# Altium schematic sheet 05-Power_A.SchDoc
size A
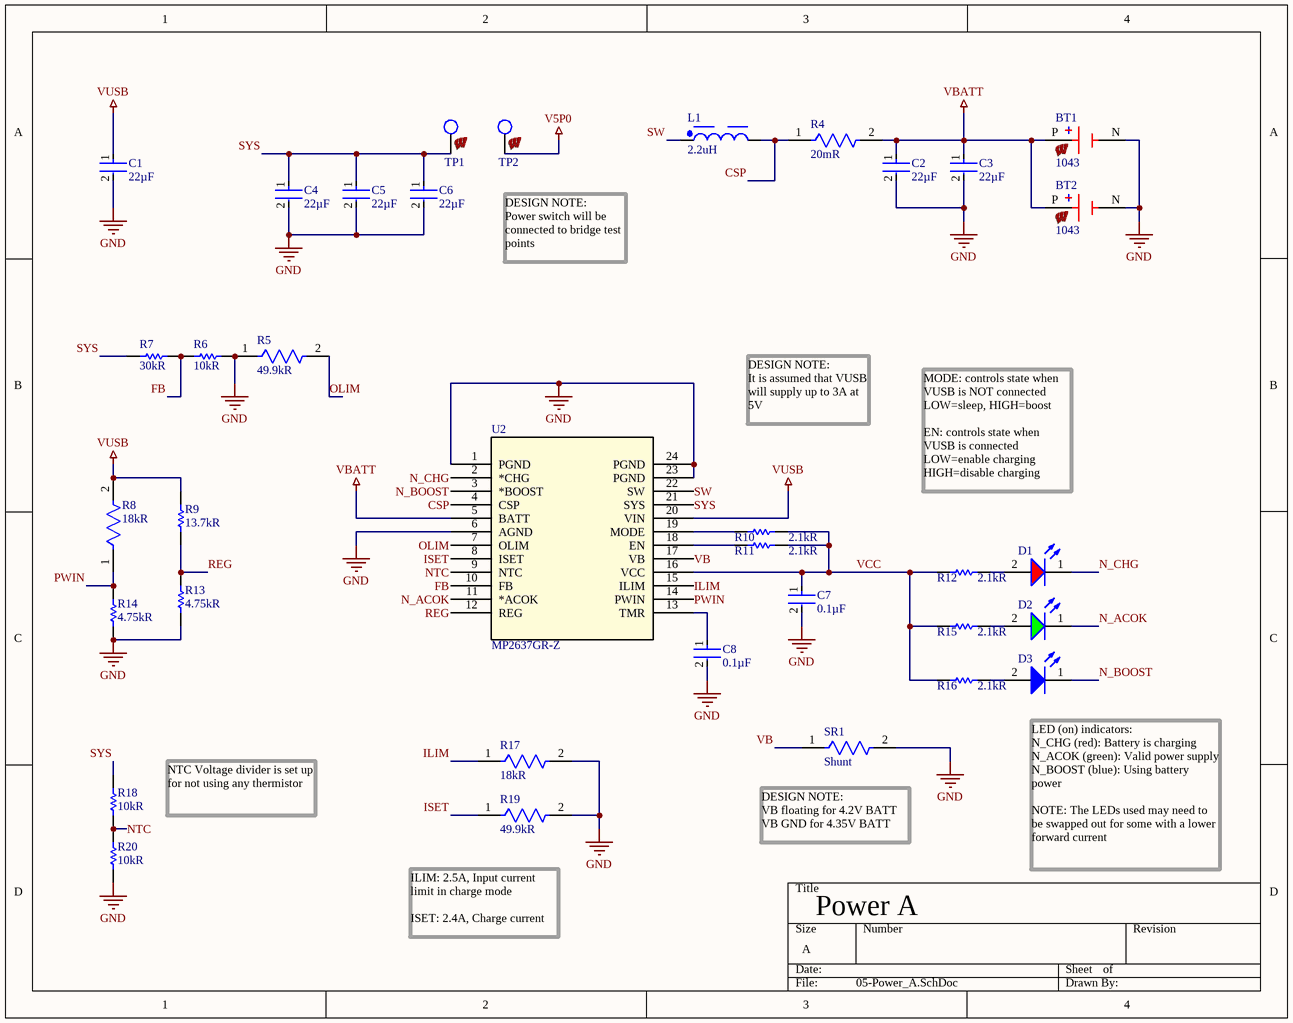
[diagram p0: 05-Power_A.SchDoc]

## Parts
BT1  1043  [BAT_1043]
BT2  1043  [BAT_1043]
C1  22µF  [FP-GRM21B-0_2-e0_2_0_7-IPC_B]
C2  22µF  [FP-GRM21B-0_2-e0_2_0_7-IPC_B]
C3  22µF  [FP-GRM21B-0_2-e0_2_0_7-IPC_B]
C4  22µF  [FP-GRM21B-0_2-e0_2_0_7-IPC_B]
C5  22µF  [FP-GRM21B-0_2-e0_2_0_7-IPC_B]
C6  22µF  [FP-GRM21B-0_2-e0_2_0_7-IPC_B]
C7  0.1µF  [FP-C0805C-DN-MFG]
C8  0.1µF  [FP-C0805C-DN-MFG]
D1  150080RS75000  [WL-SMCW_0805_150080xx75000]  (value not drawn)
D2  150080GS75000  [WL-SMCW_0805_150080xx75000]  (value not drawn)
D3  150080BS75000  [WL-SMCW_0805_150080xx75000]  (value not drawn)
L1  2.2uH  [WE-TPC_8043]
R4  20mR  [FP-CSR0805-MFG]
R5  49.9kR  [FP-RMCF0805-IPC_A]
R6  10kR  [RESC2013X70X40ML20T20]
R7  30kR  [RESC2013X70X40LL20T20]
R8  18kR  [FP-CRGP0805-IPC_C]
R9  13.7kR  [RESC2013X70X40ML20T20]
R10  2.1kR  [RESC2013X70X40ML20T20]
R11  2.1kR  [RESC2013X70X40ML20T20]
R12  2.1kR  [RESC2013X70X40ML20T20]
R13  4.75kR  [RESC2013X50X30LL20T20]
R14  4.75kR  [RESC2013X50X30LL20T20]
R15  2.1kR  [RESC2013X70X40ML20T20]
R16  2.1kR  [RESC2013X70X40ML20T20]
R17  18kR  [FP-CRGP0805-IPC_C]
R18  10kR  [RESC2013X70X40ML20T20]
R19  49.9kR  [FP-RMCF0805-IPC_A]
R20  10kR  [RESC2013X70X40ML20T20]
SR1  Shunt  [FP-CSSH0805FT1L00-MFG]
TP1  TP  [TP_UW]  (value not drawn)  (no BOM)
TP2  TP  [TP_UW]  (value not drawn)  (no BOM)
U2  MP2637GR-Z  [QFN-24_MP2637_MNP]

## Nets
GND: BT1.N(NEG) BT2.N(NEG) C1.2 C2.2 C3.2 C4.2 C5.2 C6.2 C7.2 C8.2 R5.1 R6.2 R13.1 R14.1 R17.2 R19.2 R20.1 SR1.2 U2.1(PGND) U2.6(AGND) U2.23(PGND) U2.24(PGND)
V5P0: TP2.1
VBATT: BT1.P(POS) BT2.P(POS) C2.1 C3.1 R4.2 U2.5(BATT)
VUSB: C1.1 R8.2 R9.2 U2.20(VIN)
CSP: L1.2 R4.1 U2.4(CSP)
FB: R6.1 R7.2 U2.10(FB)
ILIM: R17.1 U2.15(ILIM)
ISET: R19.1 U2.8(ISET)
N_ACOK: D2.1(K) U2.11(*ACOK)
N_BOOST: D3.1(K) U2.3(*BOOST)
N_CHG: D1.1(K) U2.2(*CHG)
NTC: R18.1 R20.2 U2.9(NTC)
OLIM: R5.2 U2.7(OLIM)
PWIN: R8.1 R14.2 U2.14(PWIN)
REG: R9.1 R13.2 U2.12(REG)
SW: L1.1 U2.22(SW)
SYS: C4.1 C5.1 C6.1 R7.1 R18.2 TP1.1 U2.21(SYS)
VB: SR1.1 U2.17(VB)
VCC: C7.1 R10.2 R11.2 R12.1 R15.1 R16.1 U2.16(VCC)
NetC8_1: C8.1 U2.13(TMR)
NetD1_2: D1.2(A) R12.2
NetD2_2: D2.2(A) R15.2
NetD3_2: D3.2(A) R16.2
NetR10_1: R10.1 U2.19(MODE)
NetR11_1: R11.1 U2.18(EN)

## Notes on the sheet
- DESIGN NOTE:
  Power switch will be connected to bridge test points
- DESIGN NOTE:
  It is assumed that VUSB will supply up to 3A at 5V
- MODE: controls state when VUSB is NOT connected
  LOW=sleep, HIGH=boost
  EN: controls state when VUSB is connected
  LOW=enable charging
  HIGH=disable charging
- NTC Voltage divider is set up for not using any thermistor
- (near SR1) DESIGN NOTE:
  VB floating for 4.2V BATT
  VB GND for 4.35V BATT
- (near D3) LED (on) indicators:
  N_CHG (red): Battery is charging
  N_ACOK (green): Valid power supply
  N_BOOST (blue): Using battery power
  NOTE: The LEDs used may need to be swapped out for some with a lower forward current
- ILIM: 2.5A, Input current limit in charge mode
  ISET: 2.4A, Charge current
- Power A

## Library data of the parts
BT1 BT2 = 1043: Manufacturer: Keystone Electronics; Price: None; Availability: Unavailable; Value: *; MP: 1043; Package: None; Supplier: Digikey; Supplier Part Number: 36-1043-ND; Manufacturer Part Number: 1043; RoHS: Yes; Category: Batteries and Accessories; Stock: 4625; Pricing: 1=3.38, 25=2.604, 100=2.328, 250=2.16176, 500=2.04398, 1000=1.9326, 2500=1.79464, 5000=1.69686 (USD); ComponentLink1URL: https://datasheet.ciiva.com/4/1043-4710.pdf?src-supplier=Digikey; ComponentLink1Description: https://datasheet.ciiva.com/4/1043-4710.pdf?src-supplier=Digikey; ComponentLink2URL: https://datasheet.ciiva.com/3353/1043-eng-tds-3353208.pdf?src-supplier=Distrelec; ComponentLink2Description: https://datasheet.ciiva.com/3353/1043-eng-tds-3353208.pdf?src-supplier=Distrelec; ComponentLink3URL: https://datasheet.ciiva.com/41803/1043-41803215.pdf?src-supplier=Digikey; ComponentLink3Description: https://datasheet.ciiva.com/41803/1043-41803215.pdf?src-supplier=Digikey; ComponentLink4URL: https://datasheet.ciiva.com/4642/1043-4642493.pdf?src-supplier=Mouser; ComponentLink4Description: https://datasheet.ciiva.com/4642/1043-4642493.pdf?src-supplier=Mouser
C1-C6 = CMP-06035-023072-1: Chip Multilayer Ceramic Capacitors for General Purpose, 0805, 22uF, X7R, 15%, 20%, 10V
C7 C8 = CMP-2007-00279-2: CAP CER 0.1UF 50V X7R 0805; Manufacturer Part Number: C0805C104K5RACTU; Manufacturer: KEMET; Value: 0.10 μF; Tolerance: 0.1; Temperature Coefficient: 30ppm/°C; Material: Ceramic; Device Class L2: Capacitors; Temperature Range Low: -55°C; Voltage Rating: 50 V; Digikey Description: CAP CER 0.1UF 50V X7R 0805; Category: Cap; ComponentLink2Description: Datasheet; Octopart: https://octopart.com/c0805c104k5ractu-kemet-143926; RoHS: TRUE; ComponentLink2URL: https://content.kemet.com/datasheets/KEM_C1003_C0G_SMD.pdf; Temperature Characteristic: X7R; Temperature: -55°C to +125°C; Height: 0.88mm; Temperature Range High: +125°C; Device Class L1: Passive Components; Automotive: No; Lead Free: Yes; Ipc Land Pattern Name: CAPC200125X78; Device Class L3: Ceramic Capacitors; Mouser Description: Cap Ceramic 0.1uF 50V X7R 10% SMD 2.0 x 1.2 mm 125 C Paper T/R; Capacitance: 0.10 μF; Package: C0805C-DN
D1 = CMP-1426-00011-3: 150080RS75000 / LED Uni-Color Red 630nm 2-Pin Chip 0805(2012Metric) T/R; Viewing Angle: 140°; Max Junction Temperature (Tj): 95°C; Power Dissipation: 72mW; Forward Current: 100mA; Forward Voltage: 2V; Wavelength: 625nm; Test Current: 20mA; Max Reverse Voltage (DC): 5V; Luminous Intensity: 150mcd; Lens Style: Clear, Rectangular; REACH SVHC: Unknown; Height: 700µm; Case Code (Metric): 2012; Peak Wavelength: 630nm; Length: 2mm; Width: 1.25mm; RoHS: Compliant; Packaging: Tape and Reel; Dominant Wavelength: 625nm; Color: Red; Case Code (Imperial): 0805; Min Operating Temperature: -40°C; Mount: Surface Mount; Max Operating Temperature: 85°C; Case/Package: 0805
D2 = CMP-1426-00007-3: WURTH ELEKTRONIK - 150080GS75000 - LED, Green, SMD, 0805, 30 mA, 3.2 V, 520 nm; Forward Voltage: 3.2V; Viewing Angle: 140°; Power Dissipation: 105mW; Peak Wavelength: 515nm; Max Reverse Voltage (DC): 5V; Luminous Intensity: 450mcd; Wavelength: 525nm; Max Junction Temperature (Tj): 95°C; Forward Current: 100mA; Test Current: 20mA; Lens Style: Clear, Rectangular; Length: 2mm; Case/Package: 0805; Case Code (Metric): 2012; Color: Green; Height: 700µm; Width: 1.25mm; Packaging: Tape and Reel; Mount: Surface Mount; REACH SVHC: Unknown; RoHS: Compliant; Min Operating Temperature: -40°C; Reverse Voltage: 5V; Max Operating Temperature: 85°C; Dominant Wavelength: 525nm; Case Code (Imperial): 0805
D3 = CMP-1426-00008-7: Led, Blue, 470 Nm, 3.2 V, 30 Ma, 145 Mcd Rohs Compliant: Yes; Dominant Wavelength: 470nm; Max Junction Temperature (Tj): 95°C; Power Dissipation: 105mW; Peak Wavelength: 465nm; Max Reverse Voltage (DC): 5V; Forward Current: 100mA; Test Current: 20mA; Luminous Intensity: 145mcd; Lens Style: Clear, Rectangular; Viewing Angle: 140°; Forward Voltage: 3.2V; Color: Blue; Height: 700µm; Case Code (Imperial): 0805; Width: 1.25mm; REACH SVHC: Unknown; Case/Package: 0805; Lead Free: Lead Free; Mount: Surface Mount; Packaging: Tape and Reel; RoHS: Compliant; Reverse Voltage: 5V; Min Operating Temperature: -40°C; Case Code (Metric): 2012; Wavelength: 470nm; Max Operating Temperature: 85°C; Length: 2mm
L1 = CMP-1479-00021-3: Fixed Ind 2.2UH 5.4A 13 Mohm SMD; NexarPartId: 23392435; Inductance Tolerance: 30%; Self Resonant Frequency: 62MHz; Inductance: 2.2µH; DC Resistance (DCR): 10mΩ; Shielding: Shielded; Series Resistance: 13mΩ; Test Frequency: 100kHz; Saturation Current: 6.3A; Core Material: Ferrite; Packaging: Cut Tape (CT); Width: 8mm; Current Rating: 5.4A; Max Operating Temperature: 125°C; Tolerance: 30%; Number of Pins: 2; Mount: Surface Mount; Termination: SMD/SMT; Min Operating Temperature: -40°C; Lead Free: Lead Free; Ambient Temperature Range High: 85°C; RMS Current (Irms): 5.4A; RoHS: Compliant; Case/Package: Nonstandard; Height: 4.3mm; Composition: Wirewound; REACH SVHC: Unknown; Ambient Temperature Range Low: -40°C; Height - Seated (Max): 4.5974mm; Max DC Current: 5.4A; Length: 8mm
R4 = CMP-26527-003859-1: General Purpose Thick Film Chip Resistor, 0805, 20mΩ, 1%, 200ppm/°C, 0.25W; Max Power Dissipation: 250mW; Case Code (Metric): 2012; Temperature Coefficient: 200ppm/°C; Number of Terminations: 2; Tolerance: 1%; Series: CSR; Length: 0.079inch; Max Operating Temperature: 155°C; Resistance: 20mR; RoHS Compliant: Yes; Case Code (Imperial): 0805; Contact Plating: Tin; Height: 0.026inch; Case/Package: 0805; Lead Free: Lead Free; Mount: Surface Mount; Min Operating Temperature: -55°C; Packaging: Tape and Reel; Width: 0.049inch; Radiation Hardening: No; Resistor Type: Thick Film
R5 R19 = CMP-26527-000576-1: 49.9kΩ ±1% 0.125W 0805 Thick Film Chip Resistor AEC-Q200 compliant; Max Power Dissipation: 125mW; Temperature Coefficient: 100ppm/°C; Lead Free: Lead Free; RoHS Compliant: Yes; Contact Plating: Tin; Construction: Rectangular; Width: 0.049inch; Number of Terminations: 2; Series: RMCF; Depth: 1.25mm; Min Operating Temperature: -55°C; Package Quantity: 1; Case Code (Imperial): 0805; Max Operating Temperature: 155°C; Radiation Hardening: No; Military Standard: Not; Resistor Type: Thick Film; Tolerance: 1%; Features: Automotive AEC-Q200; Size Code: 0805; Case Code (Metric): 2012; Height: 0.026inch; Case/Package: 0805; Mount: Surface Mount; Length: 2mm; Power Rating: 125mW; Resistance: 49.9kR; Packaging: Tape and Reel
R6 R18 R20 = CMP-2001-04376-1: Manufacturer: Panasonic; Part Number: ERJ-6ENF1002V
R7 = CMP-1013-00675-4: RES 30.0K OHM 1/8W 1% 0805 SMD; Manufacturer: Panasonic; PartNumber: ERJ-6ENF3002V; ComponentLink1URL: http://industrial.panasonic.com/cdbs/www-data/pdf/RDA0000/AOA0000C86.pdf; ComponentLink1Description: Datasheet; PackageReference: 0805
R8 R17 = CMP-03211-002159-1: CRGP0805 18KΩ 0.33W ±100ppm/°C 1% 150V; Manufacturer Part Number: CRGP0805F18K; Manufacturer: TE; Tolerance: 0.01; Device Class L3: Chip SMD Resistors; Value: 18KΩ; ComponentLink2Description: Datasheet; Temperature Range Low: -55°C; Lead Free: Yes; Temperature Coefficient: ±100ppm/°C; Resistance: 18KΩ; Series: CRGP; Temperature: -55°C to +155°C; Ambient Temperature Range High: +70°C; Package: CRGP0805; RoHS: TRUE; Octopart: https://octopart.com/crgp0805f18k-te+connectivity-91018794; Automotive: No; Device Class L2: Resistors; Voltage Rating: 150V; ComponentLink2URL: https://www.mouser.com/datasheet/2/418/NG_DS_9-1773463-9_A-1358566.pdf; Power Rating: 0.33W; Composition: Thick Film; Device Class L1: Passive Components; Category: Res; Ipc Land Pattern Name: RESC200125X55; Height: 0.65mm; Temperature Range High: +155°C
R9 = CMP-2001-04425-1: ERJ-6ENF1372V; Manufacturer: Panasonic; Part Number: ERJ-6ENF1372V
R10-R12 R15 R16 = CMP-2001-00036-1: Res Thick Film 0805 2.1K Ohm 1% 0.125W(1/8W) ±100ppm/C Pad SMD T/R Automotive AEC-Q200; Part Number: ERJ-6ENF2101V; Manufacturer: Panasonic
R13 R14 = CMP-2001-03970-1: CRCW08054K75FKTA; Manufacturer: Vishay Dale; Part Number: CRCW08054K75FKTA
SR1 = CMP-26527-002759-1: CSSH0805FT1L00 / RES SHUNT, 0805, 0.001 OHM, 1%,; RoHS Compliant: Yes
TP1 = TP: Power switch source terminal. / Debugging Test Point 0.3/0.6mm
TP2 = TP: Power switch output terminal. / Debugging Test Point 0.3/0.6mm
U2 = MP2637GR-Z: 2.5A Single Cell Switch Mode Battery Charger with Power Path Management (PPM) and 2.4A Boost Current with Trickle Timer; Manufacturer_Name: Monolithic Power Systems; Copyright: Copyright (C) 2025 Ultra Librarian. All rights reserved.; Manufacturer_Part_Number: MP2637GR-Z; Datasheet: https://www.monolithicpower.com/en/documentview/productdocument/index/version/2/document_type/Datasheet/lang/en/sku/MP2637GR-Z; RefDes: RefDes; Type: Type